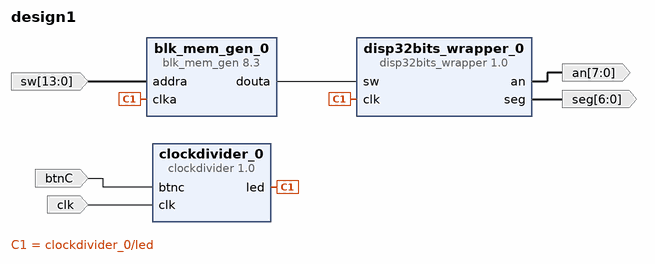
[diagram p0: block diagram of the top level]
# Vivado block design design1, xc7a100tcsg324-1, Vivado 2016.4
create_bd_design design1

create_bd_port -dir I clk
create_bd_port -dir I -from 13 -to 0 sw
create_bd_port -dir I btnC
create_bd_port -dir O -from 7 -to 0 an
create_bd_port -dir O -from 6 -to 0 seg

create_bd_cell -type ip -vlnv xilinx.com:ip:blk_mem_gen:8.3 blk_mem_gen_0
set_property -dict [list \
  CONFIG.Memory_Type Single_Port_ROM \
  CONFIG.Enable_32bit_Address false \
  CONFIG.Enable_A Always_Enabled \
  CONFIG.Register_PortA_Output_of_Memory_Primitives true \
  CONFIG.Load_Init_File true \
  CONFIG.Coe_File ../../../../../../../mul.coe \
  CONFIG.Fill_Remaining_Memory_Locations false \
  CONFIG.Use_RSTA_Pin false \
  CONFIG.Port_A_Write_Rate 0 \
  CONFIG.Port_B_Clock 0 \
  CONFIG.Port_B_Enable_Rate 0 \
  CONFIG.use_bram_block Stand_Alone \
] [get_bd_cells blk_mem_gen_0]
create_bd_cell -type ip -vlnv xilinx.com:user:disp32bits_wrapper:1.0 disp32bits_wrapper_0
create_bd_cell -type ip -vlnv xilinx.com:user:clockdivider:1.0 clockdivider_0

# ---- connections ----

connect_bd_net [get_bd_ports sw] [get_bd_pins blk_mem_gen_0/addra]
connect_bd_net [get_bd_ports btnC] [get_bd_pins clockdivider_0/btnc]
connect_bd_net [get_bd_pins disp32bits_wrapper_0/an] [get_bd_ports an]
connect_bd_net [get_bd_pins disp32bits_wrapper_0/seg] [get_bd_ports seg]
connect_bd_net [get_bd_pins blk_mem_gen_0/douta] [get_bd_pins disp32bits_wrapper_0/sw]
connect_bd_net [get_bd_pins clockdivider_0/led] [get_bd_pins disp32bits_wrapper_0/clk] [get_bd_pins blk_mem_gen_0/clka]
connect_bd_net [get_bd_ports clk] [get_bd_pins clockdivider_0/clk]

validate_bd_design
save_bd_design
